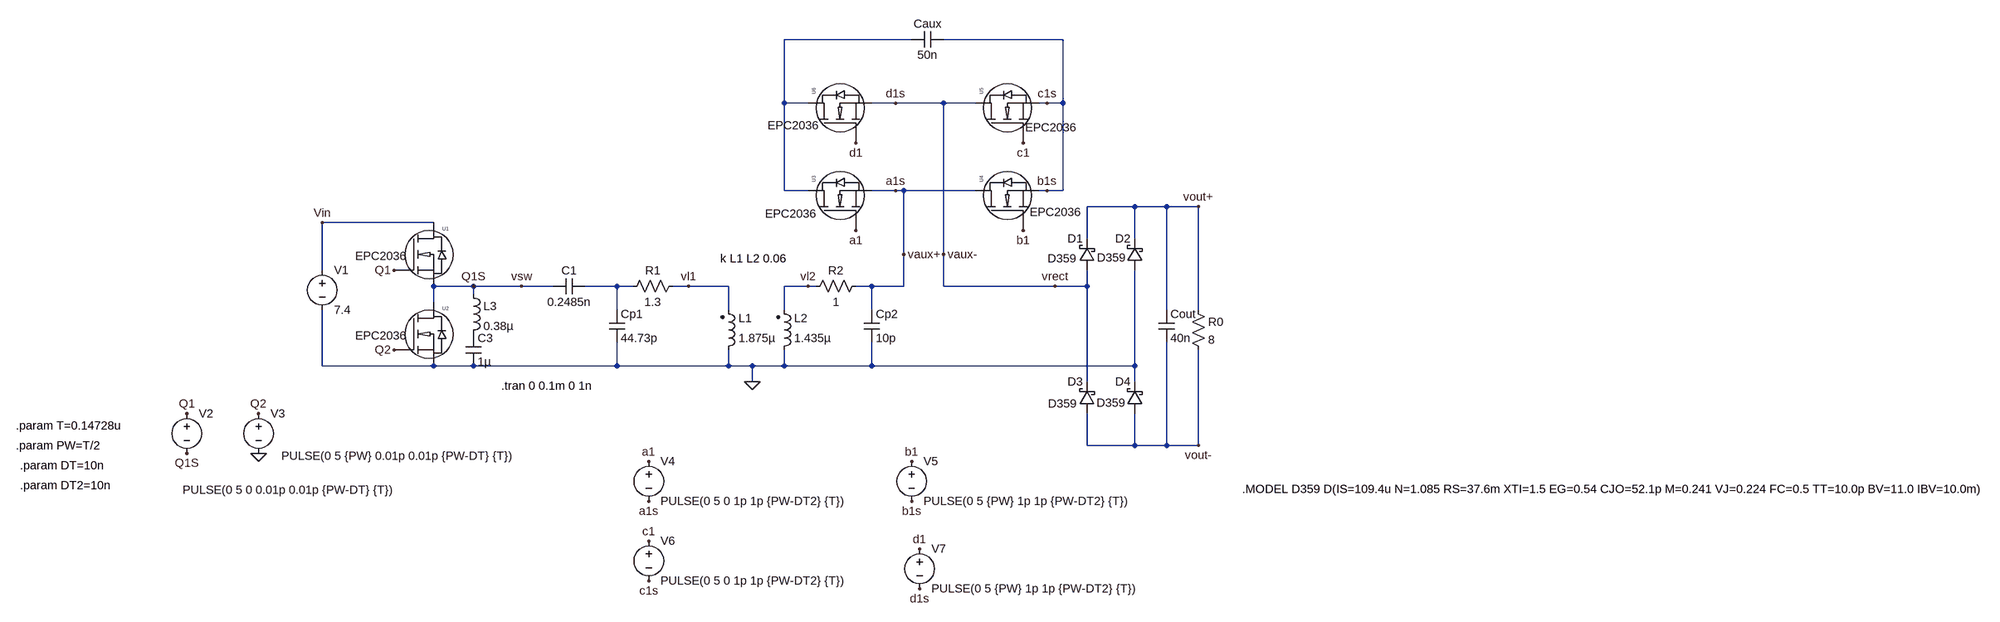
[diagram p0: schematic WPT_Coupled_full.asc]
WPT_Coupled_full.asc, the LTspice schematic file:
Version 4
SHEET 1 3032 808
WIRE 752 -384 496 -384
WIRE 1056 -384 816 -384
WIRE 496 -256 496 -384
WIRE 544 -256 496 -256
WIRE 720 -256 672 -256
WIRE 816 -256 720 -256
WIRE 880 -256 816 -256
WIRE 1024 -256 1008 -256
WIRE 1056 -256 1056 -384
WIRE 1056 -256 1024 -256
WIRE 496 -80 496 -256
WIRE 544 -80 496 -80
WIRE 720 -80 672 -80
WIRE 736 -80 720 -80
WIRE 880 -80 736 -80
WIRE 1024 -80 1008 -80
WIRE 1056 -80 1056 -256
WIRE 1056 -80 1024 -80
WIRE 1200 -48 1104 -48
WIRE 1264 -48 1200 -48
WIRE 1328 -48 1264 -48
WIRE -208 -16 -432 -16
WIRE 1104 16 1104 -48
WIRE 1200 16 1200 -48
WIRE 736 48 736 -80
WIRE 816 48 816 -256
WIRE -432 80 -432 -16
WIRE -128 112 -208 112
WIRE -32 112 -128 112
WIRE 32 112 -32 112
WIRE 160 112 96 112
WIRE 192 112 160 112
WIRE 304 112 272 112
WIRE 384 112 304 112
WIRE 544 112 496 112
WIRE 560 112 544 112
WIRE 672 112 640 112
WIRE 736 112 736 48
WIRE 736 112 672 112
WIRE 816 112 816 48
WIRE 1040 112 816 112
WIRE 1104 112 1104 80
WIRE 1104 112 1040 112
WIRE -128 128 -128 112
WIRE -208 144 -208 112
WIRE 160 160 160 112
WIRE 384 160 384 112
WIRE 496 160 496 112
WIRE 672 160 672 112
WIRE 1264 160 1264 -48
WIRE 1328 160 1328 -48
WIRE -432 272 -432 160
WIRE -208 272 -432 272
WIRE -128 272 -208 272
WIRE 160 272 160 224
WIRE 160 272 -128 272
WIRE 384 272 384 240
WIRE 384 272 160 272
WIRE 432 272 384 272
WIRE 496 272 496 240
WIRE 496 272 432 272
WIRE 672 272 672 224
WIRE 672 272 496 272
WIRE 1200 272 1200 80
WIRE 1200 272 672 272
WIRE 432 304 432 272
WIRE 1104 304 1104 112
WIRE 1200 304 1200 272
WIRE 1104 432 1104 368
WIRE 1200 432 1200 368
WIRE 1200 432 1104 432
WIRE 1264 432 1264 224
WIRE 1264 432 1200 432
WIRE 1328 432 1328 240
WIRE 1328 432 1264 432
FLAG 432 304 0
FLAG 304 112 vl1
FLAG 544 112 vl2
FLAG -288 80 Q1
FLAG -288 240 Q2
FLAG -560 448 0
FLAG -128 112 Q1S
FLAG -704 448 Q1S
FLAG 640 0 a1
FLAG 976 -176 c1
FLAG 976 0 b1
FLAG 640 -176 d1
FLAG 224 464 a1
FLAG 752 464 b1
FLAG 224 544 a1s
FLAG 752 544 b1s
FLAG 224 624 c1
FLAG 768 640 d1
FLAG 224 704 c1s
FLAG 768 720 d1s
FLAG 1328 -48 vout+
FLAG 1328 432 vout-
FLAG 736 48 vaux+
FLAG 816 48 vaux-
FLAG -432 -16 Vin
FLAG -704 368 Q1
FLAG -560 368 Q2
FLAG 720 -80 a1s
FLAG 720 -256 d1s
FLAG 1024 -80 b1s
FLAG 1024 -256 c1s
FLAG 1040 112 vrect
FLAG -32 112 vsw
SYMBOL cap 96 96 R90
WINDOW 0 0 32 VBottom 2
WINDOW 3 32 32 VTop 2
SYMATTR InstName C1
SYMATTR Value 0.2485n
SYMBOL ind2 368 256 M180
WINDOW 0 36 80 Left 2
WINDOW 3 36 40 Left 2
SYMATTR InstName L1
SYMATTR Value 1.875µ
SYMATTR Type ind
SYMBOL ind2 480 256 M180
WINDOW 0 36 80 Left 2
WINDOW 3 36 40 Left 2
SYMATTR InstName L2
SYMATTR Value 1.435µ
SYMATTR Type ind
SYMBOL res 288 96 R90
WINDOW 0 0 56 VBottom 2
WINDOW 3 32 56 VTop 2
SYMATTR InstName R1
SYMATTR Value 1.3
SYMBOL res 656 96 R90
WINDOW 0 0 56 VBottom 2
WINDOW 3 32 56 VTop 2
SYMATTR InstName R2
SYMATTR Value 1
SYMBOL res 1312 144 R0
SYMATTR InstName R0
SYMATTR Value 8
SYMBOL voltage -704 352 R0
WINDOW 123 0 0 Left 0
WINDOW 39 0 0 Left 0
WINDOW 3 -8 169 Left 2
SYMATTR Value PULSE(0 5 0 0.01p 0.01p {PW-DT} {T})
SYMATTR InstName V2
SYMBOL EPCGaN -288 80 R0
WINDOW 3 -78 -29 Left 2
SYMATTR Value EPC2036
SYMATTR InstName U1
SYMBOL EPCGaN -288 240 R0
WINDOW 3 -78 -29 Left 2
SYMATTR Value EPC2036
SYMATTR InstName U2
SYMBOL voltage -432 64 R0
WINDOW 123 0 0 Left 0
WINDOW 39 0 0 Left 0
SYMATTR InstName V1
SYMATTR Value 7.4
SYMBOL voltage -560 352 R0
WINDOW 123 0 0 Left 0
WINDOW 39 0 0 Left 0
WINDOW 3 46 101 Left 2
SYMATTR Value PULSE(0 5 {PW} 0.01p 0.01p {PW-DT} {T})
SYMATTR InstName V3
SYMBOL cap -144 208 R0
SYMATTR InstName C3
SYMATTR Value 1µ
SYMBOL ind -144 112 R0
SYMATTR InstName L3
SYMATTR Value 0.38µ
SYMBOL cap 816 -400 R90
WINDOW 0 0 32 VBottom 2
WINDOW 3 32 32 VTop 2
SYMATTR InstName Caux
SYMATTR Value 50n
SYMBOL EPCGaN 640 0 R270
WINDOW 3 34 -182 VRight 2
SYMATTR Value EPC2036
SYMATTR InstName U3
SYMBOL EPCGaN 976 0 R270
WINDOW 3 37 13 VRight 2
SYMATTR Value EPC2036
SYMATTR InstName U4
SYMBOL EPCGaN 976 -176 R270
WINDOW 3 31 4 VRight 2
SYMATTR Value EPC2036
SYMATTR InstName U5
SYMBOL EPCGaN 640 -176 R270
WINDOW 3 35 -177 VRight 2
SYMATTR Value EPC2036
SYMATTR InstName U6
SYMBOL voltage 224 448 R0
WINDOW 123 0 0 Left 0
WINDOW 39 24 124 Left 2
SYMATTR InstName V4
SYMATTR Value PULSE(0 5 0 1p 1p {PW-DT2} {T})
SYMBOL voltage 752 448 R0
WINDOW 123 0 0 Left 0
WINDOW 39 24 124 Left 2
SYMATTR InstName V5
SYMATTR Value PULSE(0 5 {PW} 1p 1p {PW-DT2} {T})
SYMBOL voltage 224 608 R0
WINDOW 123 0 0 Left 0
WINDOW 39 24 124 Left 2
SYMATTR InstName V6
SYMATTR Value PULSE(0 5 0 1p 1p {PW-DT2} {T})
SYMBOL voltage 768 624 R0
WINDOW 123 0 0 Left 0
WINDOW 39 24 124 Left 2
SYMATTR InstName V7
SYMATTR Value PULSE(0 5 {PW} 1p 1p {PW-DT2} {T})
SYMBOL cap 1248 160 R0
SYMATTR InstName Cout
SYMATTR Value 40n
SYMBOL cap 144 160 R0
SYMATTR InstName Cp1
SYMATTR Value 44.73p
SYMBOL cap 656 160 R0
SYMATTR InstName Cp2
SYMATTR Value 10p
SYMBOL schottky 1120 80 R180
WINDOW 0 24 64 Left 2
WINDOW 3 37 24 Left 2
SYMATTR InstName D1
SYMATTR Value D359
SYMBOL schottky 1216 80 R180
WINDOW 0 24 64 Left 2
WINDOW 3 34 25 Left 2
SYMATTR InstName D2
SYMATTR Value D359
SYMBOL schottky 1120 368 R180
WINDOW 0 24 64 Left 2
WINDOW 3 36 20 Left 2
SYMATTR InstName D3
SYMATTR Value D359
SYMBOL schottky 1216 368 R180
WINDOW 0 24 64 Left 2
WINDOW 3 35 22 Left 2
SYMATTR InstName D4
SYMATTR Value D359
TEXT 368 56 Left 2 !k L1 L2 0.06
TEXT -72 312 Left 2 !.tran 0 0.1m 0 1n
TEXT 1416 520 Left 2 !.MODEL D359 D(IS=109.4u N=1.085 RS=37.6m XTI=1.5 EG=0.54 CJO=52.1p M=0.241 VJ=0.224 FC=0.5 TT=10.0p BV=11.0 IBV=10.0m)
TEXT -1144 392 Left 2 !.param T=0.14728u
TEXT -1144 432 Left 2 !.param PW=T/2
TEXT -1136 472 Left 2 !.param DT=10n
TEXT -1136 512 Left 2 !.param DT2=10n

The netlist it stands for:
* WPT_Coupled_full.asc
C1 N002 vsw 0.2485n
L1 0 vl1 1.875µ
L2 0 vl2 1.435µ
R1 vl1 N002 1.3
R2 vaux+ vl2 1
R0 vout+ vout- 8
V2 Q1 vsw PULSE(0 5 0 0.01p 0.01p {PW-DT} {T})
XU1 Q1 Vin vsw EPC2036  ; pins gatein drainin N_0
XU2 Q2 vsw 0 EPC2036  ; pins gatein drainin N_0
V1 Vin 0 7.4
V3 Q2 0 PULSE(0 5 {PW} 0.01p 0.01p {PW-DT} {T})
C3 P001 0 1µ
L3 vsw P001 0.38µ
Caux c1s N001 50n
XU3 a1 N001 vaux+ EPC2036  ; pins gatein drainin N_0
XU4 b1 vaux+ c1s EPC2036  ; pins gatein drainin N_0
XU5 c1 vrect c1s EPC2036  ; pins gatein drainin N_0
XU6 d1 N001 vrect EPC2036  ; pins gatein drainin N_0
V4 a1 vaux+ PULSE(0 5 0 1p 1p {PW-DT2} {T})
V5 b1 c1s PULSE(0 5 {PW} 1p 1p {PW-DT2} {T})
V6 c1 c1s PULSE(0 5 0 1p 1p {PW-DT2} {T})
V7 d1 vrect PULSE(0 5 {PW} 1p 1p {PW-DT2} {T})
Cout vout+ vout- 40n
Cp1 N002 0 44.73p
Cp2 vaux+ 0 10p
D1 vrect vout+ D359
D2 0 vout+ D359
D3 vout- vrect D359
D4 vout- 0 D359
.model D D
.lib standard.dio
k L1 L2 0.06
.tran 0 0.1m 0 1n
.MODEL D359 D(IS=109.4u N=1.085 RS=37.6m XTI=1.5 EG=0.54 CJO=52.1p M=0.241 VJ=0.224 FC=0.5 TT=10.0p BV=11.0 IBV=10.0m)
.param T=0.14728u
.param PW=T/2
.param DT=10n
.param DT2=10n
.lib EPCGanlibrary.lib
.backanno
.end